# Altium schematic sheet SERIALIZER.SchDoc: XC7A3G-SERIALIZER
size A4; Date: 9 AUG 2026; Engineer: Parsa Malekpour; Revision: 1.0.0; SheetNumber: 15; SheetTotal: 18
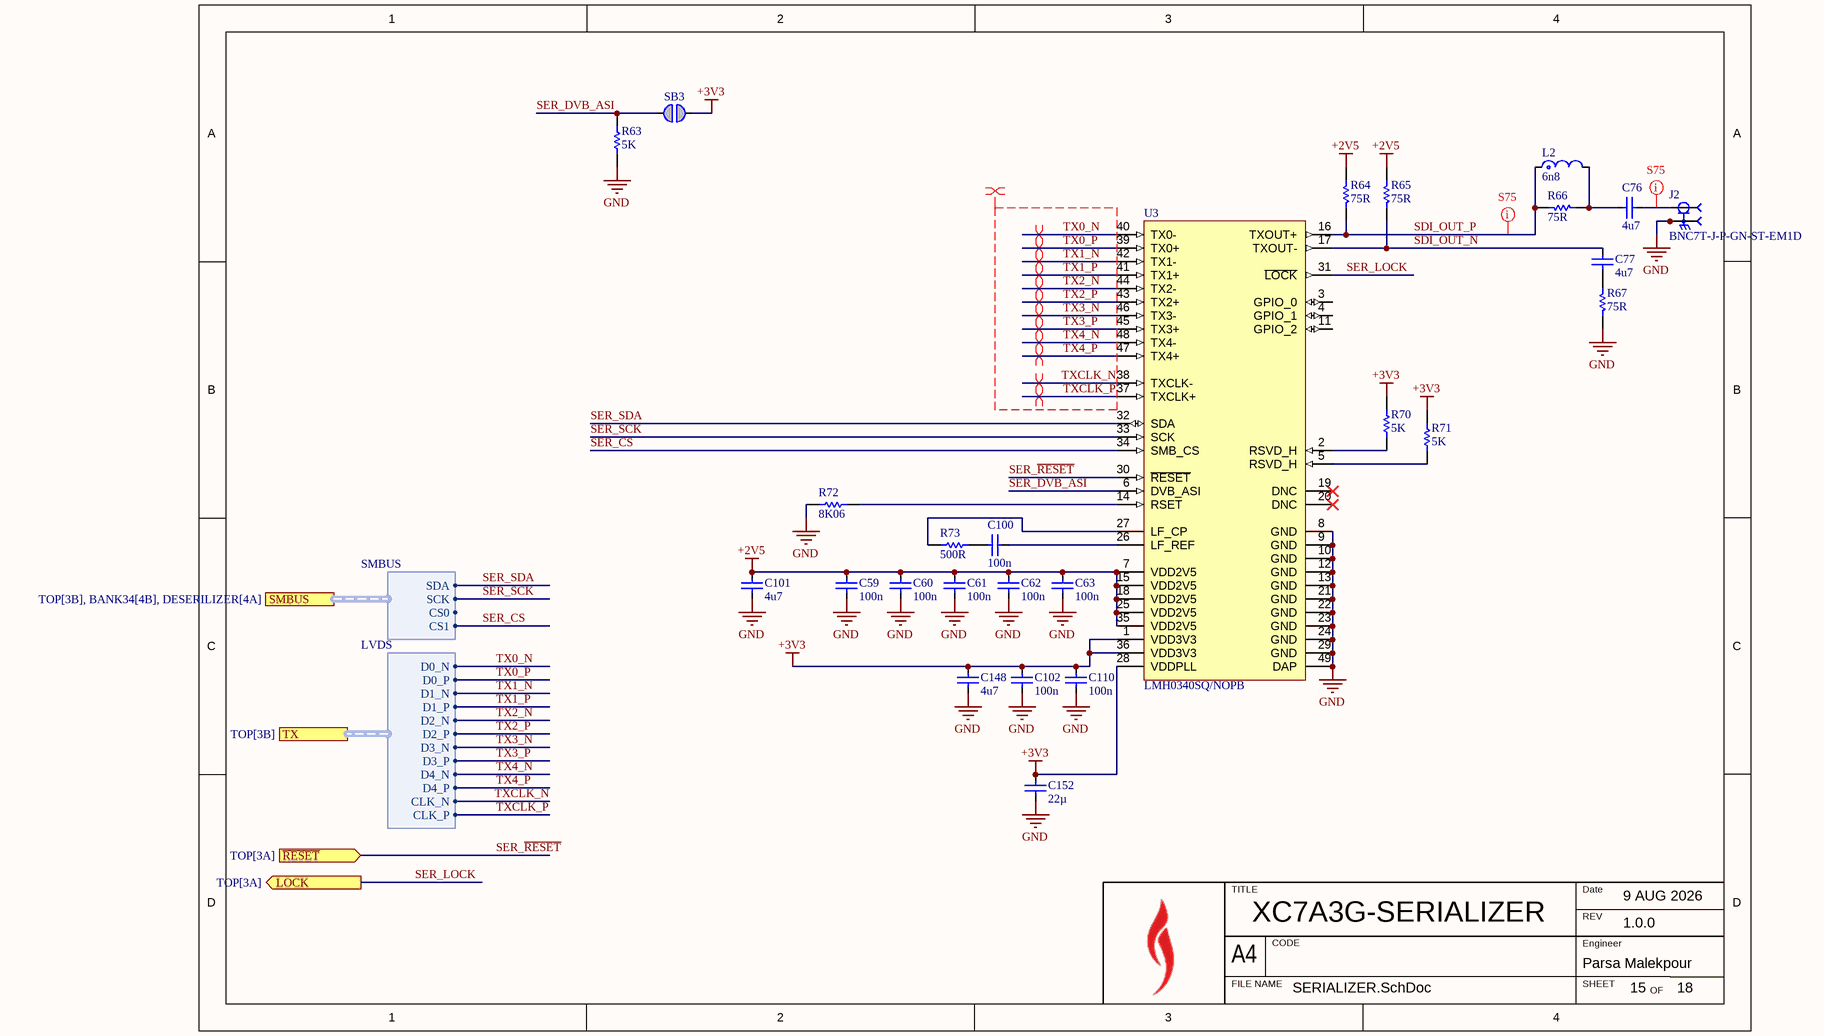
[diagram p0: SERIALIZER.SchDoc]

## Parts
C59  value 100n  [FP-C1005-050-0_05-IPC_C]  (hidden comment: C1005X7R1H104K050BB)
C60  value 100n  [FP-C1005-050-0_05-IPC_C]  (hidden comment: C1005X7R1H104K050BB)
C61  value 100n  [FP-C1005-050-0_05-IPC_C]  (hidden comment: C1005X7R1H104K050BB)
C62  value 100n  [FP-C1005-050-0_05-IPC_C]  (hidden comment: C1005X7R1H104K050BB)
C63  value 100n  [FP-C1005-050-0_05-IPC_C]  (hidden comment: C1005X7R1H104K050BB)
C76  value 4u7  [FP-C1005-050-0_20-0_10-IPC_C]  (hidden comment: C1005X5R1A475K050BE)
C77  value 4u7  [FP-C1005-050-0_20-0_10-IPC_C]  (hidden comment: C1005X5R1A475K050BE)
C100  value 100n  [FP-C1005-050-0_05-IPC_C]  (hidden comment: C1005X7R1H104K050BB)
C101  value 4u7  [FP-C1005-050-0_20-0_10-IPC_C]  (hidden comment: C1005X5R1A475K050BE)
C102  value 100n  [FP-C1005-050-0_05-IPC_C]  (hidden comment: C1005X7R1H104K050BB)
C110  value 100n  [FP-C1005-050-0_05-IPC_C]  (hidden comment: C1005X7R1H104K050BB)
C148  value 4u7  [FP-C1005-050-0_20-0_10-IPC_C]  (hidden comment: C1005X5R1A475K050BE)
C152  value 22µ  [CAPC1608X100X20LL10]  (hidden comment: C1608X5R0J226M080AC)
J2  BNC7T-J-P-GN-ST-EM1D  [SAMTEC_BNC7T-J-P-XX-ST-EM1D]
L2  value 6n8  [FP-LQP03TG_02-MFG]  (hidden comment: LQP03TN6N8J02D)
R63  value 5K  [RESC1005X40X25NL05T10]  (hidden comment: RC0402FR-075KL)
R64  value 75R  [RESC1005X40X25LL05T10]  (hidden comment: RC0402FR-0775RL)
R65  value 75R  [RESC1005X40X25LL05T10]  (hidden comment: RC0402FR-0775RL)
R66  value 75R  [RESC1005X40X25LL05T10]  (hidden comment: RC0402FR-0775RL)
R67  value 75R  [RESC1005X40X25LL05T10]  (hidden comment: RC0402FR-0775RL)
R70  value 5K  [RESC1005X40X25NL05T10]  (hidden comment: RC0402FR-075KL)
R71  value 5K  [RESC1005X40X25NL05T10]  (hidden comment: RC0402FR-075KL)
R72  value 8K06  [RESC1005X40X25LL05T10]  (hidden comment: RC0402FR-078K06L)
R73  value 500R  [RESC1005X40X25NL05T10]  (hidden comment: RT0402FRE07500RL)
SB3  Solderbridge  [Solderbridge]  (value not drawn)  (no BOM)
U3  LMH0340SQ/NOPB  [RHS0048A_V]

## Ports
LOCK (out, see TOP[3A]), SMBUS (harness SMBUS, see TOP[3B], BANK34[4B], DESERILIZER[4A]), TX (harness LVDS, see TOP[3B]), ~{RESET} (in, see TOP[3A])

## Harnesses
LVDS: D0_N, D0_P, D1_N, D1_P, D2_N, D2_P, D3_N, D3_P, D4_N, D4_P, CLK_N, CLK_P
SMBUS: SDA, SCK, CS0, CS1

## Nets
+2V5: C59.1 C60.1 C61.1 C62.1 C63.1 C101.2 R64.2 R65.2 U3.7(VDD2V5) U3.15(VDD2V5) U3.18(VDD2V5) U3.25(VDD2V5) U3.35(VDD2V5)
+3V3: C102.1 C110.1 C148.1 C152.1 R70.1 R71.1 SB3.1 U3.1(VDD3V3) U3.28(VDDPLL) U3.36(VDD3V3)
GND: C59.2 C60.2 C61.2 C62.2 C63.2 C101.1 C102.2 C110.2 C148.2 C152.2 J2.S1 J2.S2 J2.S3 J2.S4 R63.2 R67.2 R72.1 U3.8(GND) U3.9(GND) U3.10(GND) U3.12(GND) U3.13(GND) U3.21(GND) U3.22(GND) U3.23(GND) U3.24(GND) U3.29(GND) U3.49(DAP)
SDI_OUT_N: C77.2 R65.1 U3.17(TXOUT-)
SDI_OUT_P: L2.1 R64.1 R66.1 U3.16(TXOUT+)
SER_CS: U3.34(SMB_CS) ; port SMBUS.CS1
SER_DVB_ASI: R63.1 SB3.2 U3.6(DVB_ASI)
SER_LOCK: U3.31(~{LOCK}) ; port LOCK
SER_~{RESET}: U3.30(~{RESET}) ; port ~{RESET}
SER_SCK: U3.33(SCK) ; port SMBUS.SCK
SER_SDA: U3.32(SDA) ; port SMBUS.SDA
TX0_N: U3.40(TX0-) ; port TX.D0_N
TX0_P: U3.39(TX0+) ; port TX.D0_P
TX1_N: U3.42(TX1-) ; port TX.D1_N
TX1_P: U3.41(TX1+) ; port TX.D1_P
TX2_N: U3.44(TX2-) ; port TX.D2_N
TX2_P: U3.43(TX2+) ; port TX.D2_P
TX3_N: U3.46(TX3-) ; port TX.D3_N
TX3_P: U3.45(TX3+) ; port TX.D3_P
TX4_N: U3.48(TX4-) ; port TX.D4_N
TX4_P: U3.47(TX4+) ; port TX.D4_P
TXCLK_N: U3.38(TXCLK-) ; port TX.CLK_N
TXCLK_P: U3.37(TXCLK+) ; port TX.CLK_P
NetC76_1: C76.1 L2.2 R66.2
NetC76_2: C76.2 J2.1
NetC77_1: C77.1 R67.1
NetC100_1: C100.1 R73.2
NetC100_2: C100.2 U3.26(LF_REF)
NetR70_2: R70.2 U3.2(RSVD_H)
NetR71_2: R71.2 U3.5(RSVD_H)
NetR72_2: R72.2 U3.14(RSET)
NetR73_1: R73.1 U3.27(LF_CP)

Not connected (* = marked no-connect by the designer): U3 3(GPIO_0) 4(GPIO_1) 11(GPIO_2) 19(DNC)* 20(DNC)*

## Layout directives
differential pair: TX0_N, TX0_P, TX1_N, TX1_P, TX2_N, TX2_P, TX3_N, TX3_P, TX4_N, TX4_P, TXCLK_N, TXCLK_P
net class LVDS_TX: TX0_N, TX0_P, TX1_N, TX1_P, TX2_N, TX2_P, TX3_N, TX3_P, TX4_N, TX4_P, TXCLK_N, TXCLK_P
rule Impedance Constraint [Min = 70.00    Max = 80.00    ]: NetC76_2, SDI_OUT_P

## Notes on the sheet
- TITLE
- REV
- Date
- A4
- FILE NAME
- CODE
- SHEET
- Engineer
- OF

## Library data of the parts
C59-C63 C100 C102 C110 = C1005X7R1H104K050BB: MLCC 100nF ±10% 50V X7R SMD 0402; Dielectric Material: Ceramic; Voltage: 50V; Min Operating Temperature: -55°C; Depth: 0.5mm; Radiation Hardening: No; RoHS Compliant: Yes; Voltage Rating (DC): 50V; Lead Free: Lead Free; Resistor Type: Ceramic; Height: 0.5mm; Dielectric: X7R; Thickness: 0.022inch; Case/Package: 0402; Case Code (Metric): 1005; Termination: SMD/SMT; Packaging: Tape and Reel; Max Operating Temperature: 125°C; Mount: Surface Mount; Package Quantity: 1; Width: 0.02inch; Weight: 2.3E-05oz; Voltage Rating: 50V; Tolerance: 10%; Construction: Flat; Case Code (Imperial): 0402; Length: 1mm; REACH SVHC: No SVHC; Series: C; Part Number: C1005X7R1H104K050BB
C76 C77 C101 C148 = C1005X5R1A475K050BE: 4.7UF 10V X5R 0402; Tolerance: 10%; Max Operating Temperature: 85°C; Case Code (Metric): 1005; Voltage Rating: 10V; Packaging: Tape and Reel; Case/Package: 0402; Features: Soft Termination; Min Operating Temperature: -55°C; Mount: Surface Mount; Case Code (Imperial): 0402; RoHS Compliant: Yes; Part Number: C1005X5R1A475K050BE
C152 = C1608X5R0J226M080AC: MLCC 22 uF, ±20%, 6.3 V, -55 to 85 degC, 1608 (0603 Metric), RoHS, Tape and Reel; PCN Part Number: MLCCPartNumberChange30/Nov/2012; Manufacturer: TDK; Temperature Coefficient: X5R; Product Training Modules: CSeriesGeneralApplicationsSEAT,CCV,andTVCLDesignToolsGuidetoReplacinganElectrolyticCapacitorwithanMLCC; Other Names: 445-8028-1; Voltage - Rated: 6.3V; Design Resources: 20WNon-IsolatedBuckLEDDriverUsingPLLNK460KG; Online Catalog: CSeries,GeneralPurpose; Kits: 445-9003-KIT-ND-KITCAPCERHICAPMLCCSMD; Tolerance: ±20%; Series: C; Thickness (Max): 0.039"(1.00mm); Mounting Type: SurfaceMount,MLCC; Ratings: -; Datasheet Version: Mar-15; Package Reference: 603; Packaging: CutTape(CT); Features: -; Package / Case: 0603(1608Metric); Family: CeramicCapacitors; Lead Spacing: -; RoHS Information: RoHSCertificate-MLCC; Manufacturer URL: http://www.tdk.com/; Lead Style: -; Category: Capacitors; Applications: GeneralPurpose; Package Description: 2-Pin Surface Mount Device, Body 1.6 x 0.8 mm; Standard Package: 1; Datasheet URL: http://www.farnell.com/datasheets/1913358.pdf; Height - Seated (Max): -; Operating Temperature: -55degC~85degC; Size / Dimension: 0.063"Lx0.031"W(1.60mmx0.80mm)
J2 = BNC7T-J-P-GN-ST-EM1D: BNC Connector Jack, Female Socket 75Ohm Board Edge, End Launch; Panel Mount Solder; MF: Samtec Inc.; Package: None; MP: BNC7T-J-P-GN-ST-EM1D; DigiKey-Purchase-URL: https://snapeda.com/shop?store=DigiKey&id=3266999; Price: None; SnapEDA_Link: https://www.snapeda.com/parts/BNC7T-J-P-GN-ST-EM1D/Samtec%20Inc./view-part/3266999/?ref=snap; Toby_UK-Purchase-URL: https://snapeda.com/shop?store=Toby+UK&id=3266999; Value: *; Availability: Unavailable; Supplier 1: DigiKey; Supplier Part Number 1: SAM10916-ND
L2 = LQP03TN6N8J02D: Film type RF Inductor 6.8nH ±5% 300mA 0.6Ω 0201 (0603); DC Resistance (DCR): 600mR; Q Factor: 14; Shielding: Unshielded; Self Resonant Frequency: 3.9GHz; Core Material: Non-Magnetic; Test Frequency: 500MHz; Mount: Surface Mount; Case Code (Metric): 0603; Depth: 0.33mm; DC Current: 300mA; Current Rating: 300mA; Height: 0.3mm; Min Operating Temperature: -55°C; Width: 0.012inch; Height - Seated (Max): 0.013inch; Package Quantity: 15000; Max DC Current: 300mA; Radiation Hardening: No; Resistor Type: Thin Film; Packaging: Tape and Reel; Length: 0.024inch; Case Code (Imperial): 0201; Weight: 6E-06oz; Military Standard: Not; Case/Package: 0201; Termination: SMD/SMT; Max Operating Temperature: 125°C; Tolerance: 5%
R63 R70 R71 = RES: 62.5mW Thick Film Resistors 50V ±100ppm/℃ ±1% 5kΩ 0402 Chip Resistor - Surface Mount ROHS; Manufacturer: Yageo / Phycomp; Manufacturer Part Number: RC0402FR-071KL; Power Rating: 63mW; Temperature Coefficient: 100ppm/°C; Part Number: RC0402FR-075KL; Supplier: Farnell; Supplier Part Number: 2421889; RoHS: Compliant; Category: Chip SMD Resistors; Stock: 6760000; Pricing: 10000=0.464, 50000=0.406, 100000=0.336 (JPY); Case/Package: 0402; Case Code (Imperial): 0402; Case Code (Metric): 0402; China RoHS: Non-Compliant; Composition: Thick Film; Depth: 500µm; Height: 350µm; Lead Free: Lead Free; Length: 1mm; Lifecycle Status: Production; Max Operating Temperature: 155°C; Military Standard: Not; Min Operating Temperature: -55°C; Mounting Technology: Surface Mount; Pins: 2; Number of Terminals: 2; Packaging: Tape & Reel; Power Dissipation: 62.5mW; REACH SVHC: Yes; Schedule B: 8533210045, 8533210045|8533210045|8533210045|8533210045|8533210045|8533210045|8533210045|8533210045|8533210045|8533210045|8533210045|8533210045|8533210045|8533210045|8533210045|8533210045|8533210045|8533210045|8533210045|8533210045|8533210045|8533210045|8533210045|85; Termination: SMD/SMT; Tolerance: 1%; Voltage Rating: 50V; Voltage Rating (AC): 50V; Voltage Rating (DC): 50V; Width: 500µm; Working Voltage: 50V; ComponentLink1URL: https://datasheet.octopart.com:443/RC0402FR-071KL-Yageo-datasheet-175887523.pdf?src-supplier=IHS; ComponentLink1Description: https://datasheet.octopart.com:443/RC0402FR-071KL-Yageo-datasheet-175887523.pdf?src-supplier=IHS; ComponentLink2URL: https://datasheet.octopart.com:443/RC0402FR-071KL-Yageo-datasheet-164759695.pdf?src-supplier=Upverter; ComponentLink2Description: https://datasheet.octopart.com:443/RC0402FR-071KL-Yageo-datasheet-164759695.pdf?src-supplier=Upverter; ComponentLink3URL: https://datasheet.octopart.com:443/RC0402FR-071KL-Yageo-datasheet-103092701.pdf?src-supplier=Upverter; ComponentLink3Description: https://datasheet.octopart.com:443/RC0402FR-071KL-Yageo-datasheet-103092701.pdf?src-supplier=Upverter; ComponentLink4URL: https://sigma.octopart.com:443/138820526/technical_drawing/Yageo-RC0402FR-071KL.pdf?src-supplier=Upverter; ComponentLink4Description: https://sigma.octopart.com:443/138820526/technical_drawing/Yageo-RC0402FR-071KL.pdf?src-supplier=Upverter; ComponentLink5URL: https://datasheet.octopart.com:443/RC0402FR-071KL-Yageo-datasheet-98239111.pdf?src-supplier=Upverter; ComponentLink5Description: https://datasheet.octopart.com:443/RC0402FR-071KL-Yageo-datasheet-98239111.pdf?src-supplier=Upverter; ComponentLink6URL: https://datasheet.octopart.com:443/RC0402FR-071KL-Yageo-Group-datasheet-190305687.pdf?src-supplier=Future+Electronics; ComponentLink6Description: https://datasheet.octopart.com:443/RC0402FR-071KL-Yageo-Group-datasheet-190305687.pdf?src-supplier=Future+Electronics; ComponentLink7URL: https://datasheet.octopart.com:443/RC0402FR-071KL-Yageo-datasheet-12531192.pdf?src-supplier=Future+Electronics; ComponentLink7Description: https://datasheet.octopart.com:443/RC0402FR-071KL-Yageo-datasheet-12531192.pdf?src-supplier=Future+Electronics; ComponentLink8URL: https://datasheet.octopart.com:443/RC0402FR-071KL-Yageo-datasheet-137700087.pdf?src-supplier=Future+Electronics; ComponentLink8Description: https://datasheet.octopart.com:443/RC0402FR-071KL-Yageo-datasheet-137700087.pdf?src-supplier=Future+Electronics; ComponentLink9URL: https://datasheet.octopart.com:443/RC0402FR-071KL-Yageo-datasheet-8324255.pdf?src-supplier=Future+Electronics; ComponentLink9Description: https://datasheet.octopart.com:443/RC0402FR-071KL-Yageo-datasheet-8324255.pdf?src-supplier=Future+Electronics; ComponentLink10URL: https://datasheet.octopart.com:443/RC0402FR-071KL-Yageo-datasheet-10408619.pdf?src-supplier=Newark; ComponentLink10Description: https://datasheet.octopart.com:443/RC0402FR-071KL-Yageo-datasheet-10408619.pdf?src-supplier=Newark; ComponentLink11URL: https://datasheet.octopart.com:443/RC0402FR-071KL-Yageo-datasheet-8324527.pdf?src-supplier=Newark; ComponentLink11Description: https://datasheet.octopart.com:443/RC0402FR-071KL-Yageo-datasheet-8324527.pdf?src-supplier=Newark; ComponentLink12URL: https://datasheet.octopart.com:443/RC0402FR-071KL-Yageo-datasheet-62067350.pdf?src-supplier=Farnell; ComponentLink12Description: https://datasheet.octopart.com:443/RC0402FR-071KL-Yageo-datasheet-62067350.pdf?src-supplier=Farnell; ComponentLink13URL: https://datasheet.octopart.com:443/RC0402FR-071KL-Yageo-datasheet-8329306.pdf?src-supplier=element14; ComponentLink13Description: https://datasheet.octopart.com:443/RC0402FR-071KL-Yageo-datasheet-8329306.pdf?src-supplier=element14; ComponentLink14URL: https://datasheet.octopart.com:443/RC0402FR-071KL-Yageo-datasheet-505231.pdf?src-supplier=element14; ComponentLink14Description: https://datasheet.octopart.com:443/RC0402FR-071KL-Yageo-datasheet-505231.pdf?src-supplier=element14; ComponentLink15URL: https://datasheet.octopart.com:443/RC0402FR-071KL-Yageo-datasheet-175423674.pdf?src-supplier=SOS+electronic; ComponentLink15Description: https://datasheet.octopart.com:443/RC0402FR-071KL-Yageo-datasheet-175423674.pdf?src-supplier=SOS+electronic; ComponentLink16URL: https://datasheet.octopart.com:443/RC0402FR-071KL-Yageo-datasheet-148775077.pdf?src-supplier=TME; ComponentLink16Description: https://datasheet.octopart.com:443/RC0402FR-071KL-Yageo-datasheet-148775077.pdf?src-supplier=TME; ComponentLink17URL: https://datasheet.octopart.com:443/RC0402FR-071KL-Yageo-datasheet-79472498.pdf?src-supplier=Megastar; ComponentLink17Description: https://datasheet.octopart.com:443/RC0402FR-071KL-Yageo-datasheet-79472498.pdf?src-supplier=Megastar; ComponentLink18URL: https://datasheet.octopart.com/RC0402FR-071KL-Yageo-datasheet-73766026.pdf; ComponentLink18Description: https://datasheet.octopart.com/RC0402FR-071KL-Yageo-datasheet-73766026.pdf; ComponentLink19URL: http://sigma.octopart.com:80/conflict_mineral_statement/Yageo-company-3.pdf?src-supplier=Compliance+Statements; ComponentLink19Description: http://sigma.octopart.com:80/conflict_mineral_statement/Yageo-company-3.pdf?src-supplier=Compliance+Statements; ComponentLink20URL: http://sigma.octopart.com:80/rohs_statement/Yageo-company-2.pdf?src-supplier=Compliance+Statements; ComponentLink20Description: http://sigma.octopart.com:80/rohs_statement/Yageo-company-2.pdf?src-supplier=Compliance+Statements; Supplier 1: Farnell; Supplier Part Number 1: 2421889
R64-R67 = RC0402FR-0775RL: Manufacturer: Yageo / Phycomp; Part Number: RC0402FR-0775RL
R72 = RC0402FR-078K06L: Manufacturer: Yageo / Phycomp; Part Number: RC0402FR-078K06L
R73 = RT0402FRE07500RL: Res, 500R, 1%, 0.063W, Thin Film, 0402 Rohs Compliant: Yes; Manufacturer: Yageo / Phycomp; Manufacturer Part Number: RC0402FR-071KL; Power Dissipation: 62.5mW; Power Rating: 63mW; Temperature Coefficient: 100ppm/°C; Voltage Rating: 50V; Part Number: RT0402FRE07500RL; Supplier: Farnell; Supplier Part Number: 2421889; RoHS: Compliant; Category: Chip SMD Resistors; Stock: 6760000; Pricing: 10000=0.464, 50000=0.406, 100000=0.336 (JPY); Case/Package: 0402; Case Code (Imperial): 0402; Case Code (Metric): 0402; China RoHS: Non-Compliant; Composition: Thick Film; Depth: 500µm; Height: 350µm; Lead Free: Lead Free; Length: 1mm; Lifecycle Status: Production; Max Operating Temperature: 155°C; Military Standard: Not; Min Operating Temperature: -55°C; Mounting Technology: Surface Mount; Pins: 2; Number of Terminals: 2; Packaging: Tape & Reel; REACH SVHC: Yes; Schedule B: 8533210045, 8533210045|8533210045|8533210045|8533210045|8533210045|8533210045|8533210045|8533210045|8533210045|8533210045|8533210045|8533210045|8533210045|8533210045|8533210045|8533210045|8533210045|8533210045|8533210045|8533210045|8533210045|8533210045|8533210045|85; Termination: SMD/SMT; Tolerance: 1%; Voltage Rating (AC): 50V; Voltage Rating (DC): 50V; Width: 500µm; Working Voltage: 50V; ComponentLink1URL: https://datasheet.octopart.com:443/RC0402FR-071KL-Yageo-datasheet-175887523.pdf?src-supplier=IHS; ComponentLink1Description: https://datasheet.octopart.com:443/RC0402FR-071KL-Yageo-datasheet-175887523.pdf?src-supplier=IHS; ComponentLink2URL: https://datasheet.octopart.com:443/RC0402FR-071KL-Yageo-datasheet-164759695.pdf?src-supplier=Upverter; ComponentLink2Description: https://datasheet.octopart.com:443/RC0402FR-071KL-Yageo-datasheet-164759695.pdf?src-supplier=Upverter; ComponentLink3URL: https://datasheet.octopart.com:443/RC0402FR-071KL-Yageo-datasheet-103092701.pdf?src-supplier=Upverter; ComponentLink3Description: https://datasheet.octopart.com:443/RC0402FR-071KL-Yageo-datasheet-103092701.pdf?src-supplier=Upverter; ComponentLink4URL: https://sigma.octopart.com:443/138820526/technical_drawing/Yageo-RC0402FR-071KL.pdf?src-supplier=Upverter; ComponentLink4Description: https://sigma.octopart.com:443/138820526/technical_drawing/Yageo-RC0402FR-071KL.pdf?src-supplier=Upverter; ComponentLink5URL: https://datasheet.octopart.com:443/RC0402FR-071KL-Yageo-datasheet-98239111.pdf?src-supplier=Upverter; ComponentLink5Description: https://datasheet.octopart.com:443/RC0402FR-071KL-Yageo-datasheet-98239111.pdf?src-supplier=Upverter; ComponentLink6URL: https://datasheet.octopart.com:443/RC0402FR-071KL-Yageo-Group-datasheet-190305687.pdf?src-supplier=Future+Electronics; ComponentLink6Description: https://datasheet.octopart.com:443/RC0402FR-071KL-Yageo-Group-datasheet-190305687.pdf?src-supplier=Future+Electronics; ComponentLink7URL: https://datasheet.octopart.com:443/RC0402FR-071KL-Yageo-datasheet-12531192.pdf?src-supplier=Future+Electronics; ComponentLink7Description: https://datasheet.octopart.com:443/RC0402FR-071KL-Yageo-datasheet-12531192.pdf?src-supplier=Future+Electronics; ComponentLink8URL: https://datasheet.octopart.com:443/RC0402FR-071KL-Yageo-datasheet-137700087.pdf?src-supplier=Future+Electronics; ComponentLink8Description: https://datasheet.octopart.com:443/RC0402FR-071KL-Yageo-datasheet-137700087.pdf?src-supplier=Future+Electronics; ComponentLink9URL: https://datasheet.octopart.com:443/RC0402FR-071KL-Yageo-datasheet-8324255.pdf?src-supplier=Future+Electronics; ComponentLink9Description: https://datasheet.octopart.com:443/RC0402FR-071KL-Yageo-datasheet-8324255.pdf?src-supplier=Future+Electronics; ComponentLink10URL: https://datasheet.octopart.com:443/RC0402FR-071KL-Yageo-datasheet-10408619.pdf?src-supplier=Newark; ComponentLink10Description: https://datasheet.octopart.com:443/RC0402FR-071KL-Yageo-datasheet-10408619.pdf?src-supplier=Newark; ComponentLink11URL: https://datasheet.octopart.com:443/RC0402FR-071KL-Yageo-datasheet-8324527.pdf?src-supplier=Newark; ComponentLink11Description: https://datasheet.octopart.com:443/RC0402FR-071KL-Yageo-datasheet-8324527.pdf?src-supplier=Newark; ComponentLink12URL: https://datasheet.octopart.com:443/RC0402FR-071KL-Yageo-datasheet-62067350.pdf?src-supplier=Farnell; ComponentLink12Description: https://datasheet.octopart.com:443/RC0402FR-071KL-Yageo-datasheet-62067350.pdf?src-supplier=Farnell; ComponentLink13URL: https://datasheet.octopart.com:443/RC0402FR-071KL-Yageo-datasheet-8329306.pdf?src-supplier=element14; ComponentLink13Description: https://datasheet.octopart.com:443/RC0402FR-071KL-Yageo-datasheet-8329306.pdf?src-supplier=element14; ComponentLink14URL: https://datasheet.octopart.com:443/RC0402FR-071KL-Yageo-datasheet-505231.pdf?src-supplier=element14; ComponentLink14Description: https://datasheet.octopart.com:443/RC0402FR-071KL-Yageo-datasheet-505231.pdf?src-supplier=element14; ComponentLink15URL: https://datasheet.octopart.com:443/RC0402FR-071KL-Yageo-datasheet-175423674.pdf?src-supplier=SOS+electronic; ComponentLink15Description: https://datasheet.octopart.com:443/RC0402FR-071KL-Yageo-datasheet-175423674.pdf?src-supplier=SOS+electronic; ComponentLink16URL: https://datasheet.octopart.com:443/RC0402FR-071KL-Yageo-datasheet-148775077.pdf?src-supplier=TME; ComponentLink16Description: https://datasheet.octopart.com:443/RC0402FR-071KL-Yageo-datasheet-148775077.pdf?src-supplier=TME; ComponentLink17URL: https://datasheet.octopart.com:443/RC0402FR-071KL-Yageo-datasheet-79472498.pdf?src-supplier=Megastar; ComponentLink17Description: https://datasheet.octopart.com:443/RC0402FR-071KL-Yageo-datasheet-79472498.pdf?src-supplier=Megastar; ComponentLink18URL: https://datasheet.octopart.com/RC0402FR-071KL-Yageo-datasheet-73766026.pdf; ComponentLink18Description: https://datasheet.octopart.com/RC0402FR-071KL-Yageo-datasheet-73766026.pdf; ComponentLink19URL: http://sigma.octopart.com:80/conflict_mineral_statement/Yageo-company-3.pdf?src-supplier=Compliance+Statements; ComponentLink19Description: http://sigma.octopart.com:80/conflict_mineral_statement/Yageo-company-3.pdf?src-supplier=Compliance+Statements; ComponentLink20URL: http://sigma.octopart.com:80/rohs_statement/Yageo-company-2.pdf?src-supplier=Compliance+Statements; ComponentLink20Description: http://sigma.octopart.com:80/rohs_statement/Yageo-company-2.pdf?src-supplier=Compliance+Statements; Supplier 1: DigiKey; Supplier Part Number 1: 13-RT0402FRE07500RLCT-ND
SB3 = Solderbridge_1: Manufacturer: N.A.; Pad Count: 2; Part Number: Solderbridge; Manufacturer Part Number: N.A.; LatestRevisionDate: 2009-12-14; Published: 2009-12-14; Value: Solderbridge; Note: N.A.; Artikkelnr Noca: N.A.; Footprint Doc: Solderbridge; Part number IPS: N.A.; ComponentLink1URL: N.A.; ComponentLink1Description: Datasheet; ComponentLink2URL: N.A.; ComponentLink2Description: Supplier link; HelpURL: N.A.; Supplier 1: N.A.; Supplier Part Number 1: N.A.; Supplier 2: N.A.; Supplier Part Number 2: N.A.; Component Class: Connectors; PartId: 100500458
U3 = CMP-0058-00394-3: 3 Gbps, HD, SD, DVB-ASI SDI Serializer and Driver with LVDS Interface, 48-pin LLP, Pb-Free; Manufacturer: Texas Instruments; CompType: Interface IC; PackageTopMarking: NS*UZXYTTE#*L0340; PowerWise: N; Code_JEDEC: MO-220-WKKD-2; PackageReference: RHS0048A; PackageDescription: LLP, Plastic, Quad, 7 x 7 x 0.8mm Body, 48 Lead, 0.5mm Pitch, No Pullback; ComponentLink1Description: Datasheet URL; ComponentLink1URL: http://www.ti.com/general/docs/lit/getliterature.tsp?genericPartNumber=LMH0340&fileType=pdf; PinCount: 48; RoHS: Y; Supplier 1: Arrow Electronics; Supplier Part Number 1: LMH0340SQ/NOPB